# Altium schematic sheet 09_RS232.SchDoc
size A3
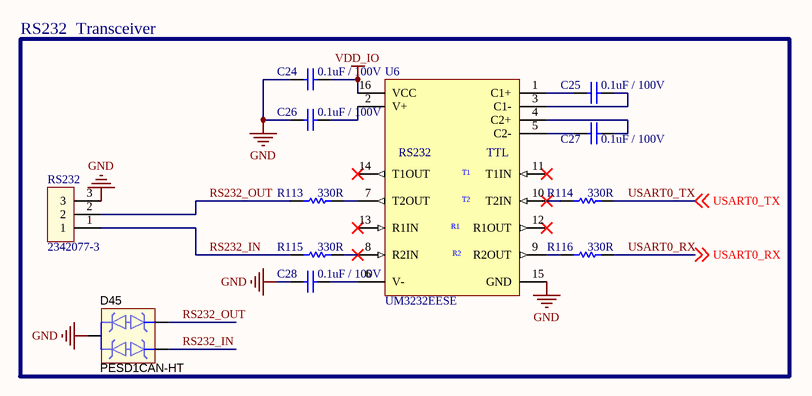
[diagram p0: 09_RS232.SchDoc]

## Parts
C24  0.1uF / 100V  [603C]
C25  0.1uF / 100V  [603C]
C26  0.1uF / 100V  [603C]
C27  0.1uF / 100V  [603C]
C28  0.1uF / 100V  [603C]
D45  PESD1CAN-HT  [ONSC-SOT-23-3-318-08_V]
R113  330R  [603R]
R114  330R  [603R]
R115  330R  [603R]
R116  330R  [603R]
RS232  2342077-3  [TERM BLOCK HDR 3POS 90DEG PITCH 3.81MM]
U6  UM3232EESE  [SOIC127P600X175-16N]

## Blocks framed on the sheet
RS232  Transceiver: C24-C28 D45 R113-R116 RS232 U6

## Nets
GND: C24.1 C26.1 C28.1 D45.3 RS232.3 U6.15(GND)
VDD_IO: C24.2 U6.16(VCC)
RS232_IN: D45.1 R115.2 RS232.1
RS232_OUT: D45.2 R113.1 RS232.2
USART0_RX: R116.1 ; off-sheet USART0_RX
USART0_TX: R114.2 ; off-sheet USART0_TX
NetC25_1: C25.1 U6.1(C1+)
NetC25_2: C25.2 U6.3(C1-)
NetC26_2: C26.2 U6.2(V+)
NetC27_1: C27.1 U6.5(C2-)
NetC27_2: C27.2 U6.4(C2+)
NetC28_2: C28.2 U6.6(V-)
NetR113_2: R113.2 U6.7(T2OUT)
NetR114_1: R114.1 U6.10(T2IN)
NetR115_1: R115.1 U6.8(R2IN)
NetR116_2: R116.2 U6.9(R2OUT)

Not connected (* = marked no-connect by the designer): U6 11(T1IN)* 12(R1OUT)* 13(R1IN)* 14(T1OUT)*

## Notes on the sheet
- (in symbol IC TRANSCEIVER FULL 2/2 16SOIC 3.90mm Width) RS232; TTL; T1; T2; R1; R2

## Library data of the parts
C24-C28 = CAP CER 0.1UF 100V X7R 0603: 0.1 µF ±10% 100V Ceramic Capacitor X7R 0603 (1608 Metric); Manufacturer: Venkel; Manufacturer Part Number: C0603X7R101-104KNP; Value: 0.1uF / 100V; Digi-Key Part Number: 2679-C0603X7R101-104KNPTR-ND; Tolerance: ±10%; Voltage - Rated: 100V; Temperature Coefficient: X7R; Operating Temperature: -55°C ~ 125°C; Applications: General Purpose; Package / Case: 0603 (1608 Metric)
D45 = TVS DIODE 24V 40VC SOT23-3 PESD1CAN-HT: 24V, 40V Clamp 3A (8/20µs) Ipp Tvs Diode Surface Mount SOT-23-3; Manufacturer: Hottech; Type: Zener; Voltage - Breakdown (Min): 25.4V; Power - Peak Pulse: 200W; Power Line Protection: No; Capacitance @ Frequency: 17pF @ 1MHz; Bidirectional Channels: 2; Digi-Key Part Number: https://www.ozdisan.com/guc-yari-iletkenleri/diyotlar-modul-diyotlar-ve-dogrultucular/tvs-diyotlar/PESD1CAN-HT; Manufacturer Part Number: PESD1CAN-HT; Voltage - Reverse Standoff (Typ): 24V; Voltage - Clamping (Max) @ Ipp: 40V; Current - Peak Pulse (10/1000µs): 3A (8/20µs); Operating Temperature: -50°C ~ 125°C (TJ); Package / Case: TO-236-3, SC-59, SOT-23-3; Value: PESD1CAN-HT; Applications: RS-232
R113-R116 = RES_330_OHM_%5_0.1W_0603: 330 Ohms ±5% 0.1W, 1/10W Chip Resistor 0603 (1608 Metric) Moisture Resistant Thick Film; Manufacturer: Yageo; Manufacturer Part Number: RC0603JR-07330RL; Temperature Coefficient: ±100ppm/°C; Value: 330R; Digi-Key Part Number: 311-330GRTR-ND; Tolerance: ±5%; Power (Watts): 0.1W, 1/10W; Composition: Thick Film; Operating Temperature: -55°C ~ 155°C; Package / Case: 0603 (1608 Metric); Size / Dimension: 0.063" L x 0.032" W (1.60mm x 0.80mm); Height - Seated (Max): 0.022" (0.55mm); Features: Moisture Resistant
RS232 = TERM BLOCK HDR 3POS 90DEG 3.81MM: 3 Position Terminal Block Header, Male Pins, Shrouded (4 Side) 0.150" (3.81mm) 90°, Right Angle - Through Hole; Manufacturer: TE Connectivity AMP Connectors; Contact Tail Length: 0.075" (1.90mm); Digi-Key Part Number: A145322-ND; Value: 2342077-3; Pitch: 0.150" (3.81mm); Header Orientation: 90°, Right Angle; Insulation Height: 0.285" (7.25mm)
U6 = IC TRANSCEIVER FULL 2/2 16SOIC 3.90mm Width: 2/2 Transceiver Full RS232 3.3Volts 16-SOIC (0.154", 3.90mm Width); Data Rate: 250kbps; Voltage - Supply: 3V ~ 5.5V; Digi-Key Part Number: 3351-UM3232EESETR-ND; Value: UM3232EESE; Number of Drivers/Receivers: 2/2; Operating Temperature: -40°C ~ 85°C (TA); Package / Case: 16-SOIC (0.154", 3.90mm Width)